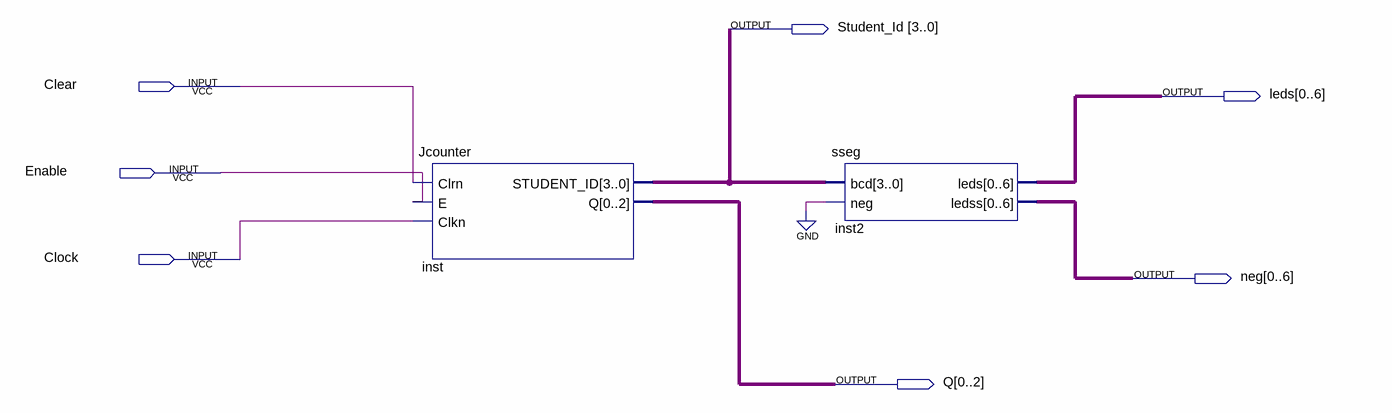
[diagram p0: schematic sheet]
// Quartus schematic circuit.bdf as structural Verilog: 2 symbols, 7 pins
module circuit (
  input  Clear,
  input  Enable,
  input  Clock,
  output [3:0] Student_Id,
  output [0:6] leds,
  output [0:6] neg,
  output [0:2] Q
);

  Jcounter inst (.Clrn(Clear), .E(Enable), .Clkn(Clock), .STUDENT_ID(Student_Id), .Q(Q));
  sseg inst2 (.bcd(Student_Id), .neg(1'b0), .leds(leds), .ledss(neg));
endmodule
